# Altium schematic sheet Sheet2.SchDoc
size A; SheetNumber: 1; SheetTotal: 1
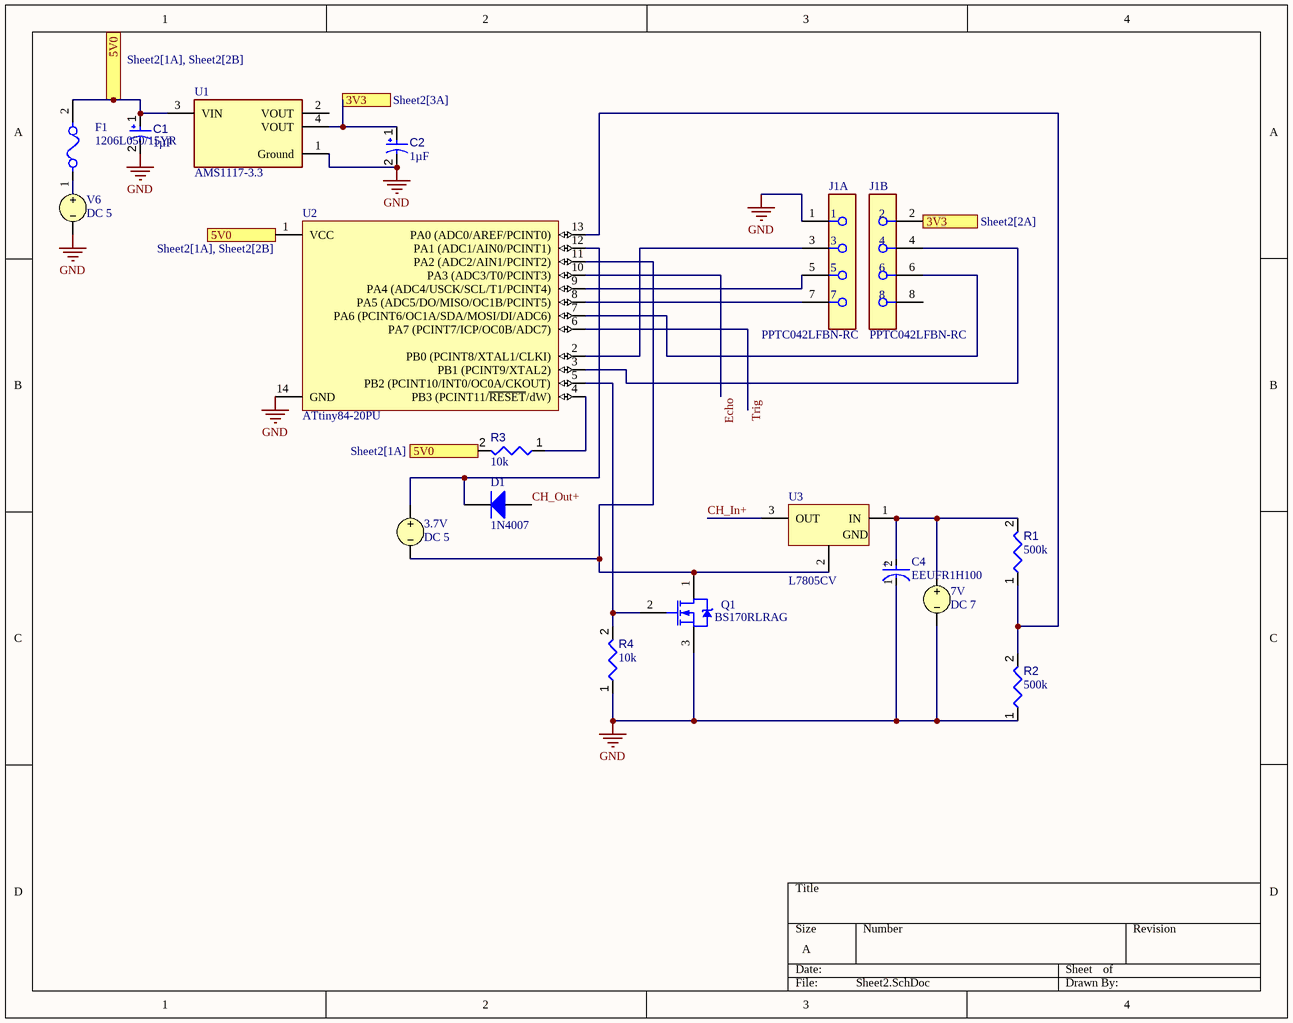
[diagram p0: Sheet2.SchDoc]

## Parts
3.7V  DC 5
7V  DC 7
C1  value 1µF  [CAPPR55-200-1100X500X1200]  (hidden comment: ECA-1HHG010)
C2  value 1µF  [CAPPR55-200-1100X500X1200]  (hidden comment: ECA-1HHG010)
C4  EEUFR1H100  [FP-RAD-TH-D_5_0_5-L_11_1-MFG]
D1  1N4007  [FAIR-DO-41-2]
F1  1206L050/15YR  [FP-1206L-MFG]
J1  PPTC042LFBN-RC  [FP-PPTC042LFBN-RC-MFG]  (parts A,B of 2)
Q1  BS170RLRAG  [ONSC-TO-92-3-29-11_AM_BL]
R1  value 500k  [RESA60-630X240]  (hidden comment: MFR-25FBF52-1K)
R2  value 500k  [RESA60-630X240]  (hidden comment: MFR-25FBF52-1K)
R3  value 10k  [RESA60-630X240]  (hidden comment: MFR-25FBF52-1K)
R4  value 10k  [RESA60-630X240]  (hidden comment: MFR-25FBF52-1K)
U1  AMS1117-3.3  [FP-AMS1117-IPC_C]
U2  ATtiny84-20PU  [14P3]
U3  L7805CV  [TO220]
V6  DC 5

## Ports
3V3 (see Sheet2[2A]), 3V3 (see Sheet2[3A]), 5V0 (see Sheet2[1A]), 5V0 (see Sheet2[1A], Sheet2[2B])

## Nets
GND: 7V.2 C1.2 C2.2 C4.1(C) J1.1 Q1.3(S) R2.1 R4.1 U1.1(Ground) U2.14(GND) V6.2
3V3: C2.1 J1.2 U1.4(VOUT) ; port 3V3
5V0: C1.1 F1.2 R3.2 U1.3(VIN) U2.1(VCC) ; port 5V0
CH_In+: U3.3(OUT)
CH_Out+: D1.2(A)
Echo: U2.10(PA3_(ADC3/T0/PCINT3))
Trig: U2.6(PA7_(PCINT7/ICP/OC0B/ADC7))
Net3.7V_1: 3.7V.1 D1.1(K) U2.12(PA1_(ADC1/AIN0/PCINT1))
Net3.7V_2: 3.7V.2 Q1.1(D) U2.11(PA2_(ADC2/AIN1/PCINT2)) U3.2(GND)
Net7V_1: 7V.1 C4.2(A) R1.2 U3.1(IN)
NetF1_1: F1.1 V6.1
NetJ1_3: J1.3 U2.2(PB0_(PCINT8/XTAL1/CLKI))
NetJ1_4: J1.4 U2.3(PB1_(PCINT9/XTAL2))
NetJ1_5: J1.5 U2.9(PA4_(ADC4/USCK/SCL/T1/PCINT4))
NetJ1_6: J1.6 U2.7(PA6_(PCINT6/OC1A/SDA/MOSI/DI/ADC6))
NetJ1_7: J1.7 U2.8(PA5_(ADC5/DO/MISO/OC1B/PCINT5))
NetQ1_2: Q1.2(G) R4.2 U2.5(PB2_(PCINT10/INT0/OC0A/CKOUT))
NetR1_1: R1.1 R2.2 U2.13(PA0_(ADC0/AREF/PCINT0))
NetR3_1: R3.1 U2.4(PB3_(PCINT11/~{RESET}/dW))

Not connected (* = marked no-connect by the designer): J1 8; U1 2(VOUT)

## Notes on the sheet
- (in symbol CMP-05427-001295-1) +

## Library data of the parts
3.7V V6 = VSRC: Voltage Source; Note: PCB Footprint - Not required; AC Magnitude: 1; AC Phase: 0; Value: 5; Published: 8-Jun-2000; LatestRevisionDate: 17-Jul-2002; LatestRevisionNote: Re-released for DXP Platform.; PackageReference: Not Applicable; Publisher: Altium Limited
7V = VSRC: Voltage Source; Note: PCB Footprint - Not required; AC Magnitude: 0; Value: 7; Published: 8-Jun-2000; LatestRevisionDate: 17-Jul-2002; LatestRevisionNote: Re-released for DXP Platform.; PackageReference: Not Applicable; Publisher: Altium Limited; AC Phase: 0
C1 C2 = CMP-001-00024-7: Aluminum Electrolytic Capacitor, 1 uF, +/- 20%, 50 V, -55 to 105 degC, 2-Pin THD, RoHS, Bulk; Manufacturer: Panasonic; Voltage Rating: 50V; Ripple Current: 10mA; Packaging: Bulk; Package Quantity: 200; Tolerance: 20%; Min Operating Temperature: -55°C; Diameter: 5mm; Capacitor Type: Electrolytic; Datasheet Version: Mar-05; Ripple Current (AC): 10mA; Manufacturer URL: http://www.panasonic.com/; Case/Package: Radial; Mounting Technology: TH; Pins: 2; Package Reference: CAPPR55-200-1100X500X1200; Package Description: 2-Pin Radial Lead, Dia 5 mm, Height 12 mm; RoHS Compliant: True; Max Operating Temperature: 105°C; Lead Pitch: 2mm; Datasheet URL: https://datasheet.ciiva.com/7275/94060-7275472.pdf
C4 = CMP-05427-001295-1: Aluminum Electrolytic Capacitors (Radial Lead Type) 10uF ±20% 50V; Lead Diameter: 0.5mm; Life (Hours): 5000Hour; Impedance: 340mR; Ripple Current (AC): 250mA; REACH SVHC: Yes; Tolerance: 20%; Construction: RADIAL; Min Operating Temperature: -40°C; Termination: Radial; Voltage Rating: 50V; Height: 11mm; Max Operating Temperature: 105°C; Capacitance: 10uF; Voltage: 50V; Diameter: 5mm; Lead Pitch: 2mm; Series: FR Radial; RoHS Compliant: Yes; Case/Package: Radial
D1 = CMP-004-00007-2: General Purpose Rectifier, 1.1 V, 1.0 A, -55 to 175 degC, 2-Pin DO-41, RoHS, Tape and Reel; Manufacturer: Fairchild; Peak Reverse Current: 5uA; Max Surge Current: 30A; Elements: 1; Forward Voltage: 1.1V; Package Version: Rev. 2, 09/2008; Forward Current: 1A; Package Quantity: 5000; Packaging: TapeandReel; Package URL: http://www.fairchildsemi.com/dwg/DO/DO41A.pdf; Manufacturer URL: https://www.fairchildsemi.com/; Package Reference: DO-41-2; Pins: 2; Min Operating Temperature: -55°C; Datasheet Version: Rev. 1.1.0, 11/2014; Max Operating Temperature: 175°C; RoHS Compliant: True; Case/Package: DO-41-2; Mounting Technology: TH; Package Description: 2-Pin Axial Lead, Dia 2.375 mm, Body Length 4.63 mm; Datasheet URL: https://www.fairchildsemi.com/datasheets/1N/1N4007.pdf
F1 = CMP-08606-000030-1: PTC RESET FUSE 15V 500MA 1206; Manufacturer: Littelfuse Inc; Trip Time: 0.1s; Trip Current: 1A; Value: 0.15-0.75Ω; Hold Current: 0.5A; Current Rating: 100A; Device Class L2: PTC Resettable Fuses; Height: 0.75mm; Temperature Range High: +85°C; Automotive: No; Package: 1206L; Lead Free: Yes; Mouser Description: Resettable Fuses - PPTC 15V 1206 .500A POLYFUSE; Digikey Description: PTC RESET FUSE 15V 500MA 1206; Manufacturer Part Number: 1206L050/15YR; Voltage Rating: 15V; Temperature Range Low: -40°C; Device Class L3: unset; Device Class L1: Circuit Protection; ComponentLink2URL: https://www.littelfuse.com/~/media/electronics/datasheets/resettable_ptcs/littelfuse_ptc_1206l_datasheet.pdf.pdf; RoHS: TRUE; Ambient Temperature Range High: +85°C; Temperature: -40°C to +85°C; Resistance: 0.15-0.75Ω; Ambient Temperature Range Low: -40°C; Octopart: https://octopart.com/1206l050%2F15yr-littelfuse-673645; ComponentLink2Description: Datasheet; Category: Fuse
J1 = CMP-25680-000004-1: CONN HDR 8POS 0.1 TIN PCB; Manufacturer: Sullins; Is Female: yes; Conn Orientation: Straight; Conn Gender: Female; Number Of Contacts: 8; Pitch: 2.54mm; Voltage Rating: 250V; Current Rating: 3A; Package: PPTC042LFBN-RC; Number Of Rows: 2; Manufacturer Part Number: PPTC042LFBN-RC; Contact Material: Tin,Nickel; Temperature: -40°C to +105°C; Height: 8.65mm; Device Class L2: Headers and Wire Housings; Octopart: https://octopart.com/pptc042lfbn-rc-sullins-271088; RoHS: TRUE; ComponentLink2URL: https://drawings-pdf.s3.amazonaws.com/10492.pdf; Lead Free: Yes; Automotive: No; Device Class L3: unset; ComponentLink2Description: Datasheet; Temperature Range High: +105°C; Digikey Description: CONN HDR 8POS 0.1 TIN PCB; Category: Conn; Device Class L1: Connectors; Temperature Range Low: -40°C
Q1 = CMP-1058-00945-1: Small Signal MOSFET, 500 mA, 60 V, N-Channel, 3-Pin TO-92, Pb-Free, Tape and Reel; Manufacturer: On Semiconductor; VGS(th) Max (V): 3; V(BR)DSS Min (V): 60; PD Max (W): 0.35; ID Max (A): 0.5; Channel Polarity: N Channel; VGS Max (V): 20; Configuration: Single; PackageDescription: 3-Pin Transistor Outline, Body 4.825 x 3.685 mm, Pitch 1.27 mm; ComponentLink3Description: Package Specification; DatasheetVersion: Rev. 6; RoHS: Pb-Free; Mounting Technology: Through Hole; ComponentLink1Description: Manufacturer URL; PackageVersion: Rev. AM; ComponentLink2Description: Datasheet; ComponentLink1URL: http://www.onsemi.com/; PackageReference: TO-92-3-29-11_AM_BL; ComponentLink3URL: http://www.onsemi.com/pub_link/Collateral/MAC97-D.PDF; Packing: Tape and Reel; PartNumber: BS170RLRAG; ComponentLink2URL: http://www.onsemi.com/pub_link/Collateral/BS170-D.PDF; Package Type: TO-92
R1-R4 = CMP-009-00048-4: Axial Resistor, 1 KOhm, +/- 1%, 250 mW, -55 to 155 degC, 2-Pin THD, RoHS, Bulk; Manufacturer: Yageo; Voltage Rating: 250V; Power: 250mW; Min Operating Temperature: -55°C; Max Operating Temperature: 155°C; Tolerance: 1%; Package Reference: MFR-25; Composition: CarbonFilm; Mounting Technology: TH; Packaging: Bulk; Case/Package: Axial; Datasheet URL: http://www.yageo.com/documents/recent/Yageo%20LR_MFR_2013.pdf; Package Quantity: 200; Manufacturer URL: http://www.yageo.com/; Package Description: 2-Pin Axial Lead, Dia 2.4 mm, Body Length 6.3 mm; Datasheet Version: Apr-13; RoHS Compliant: True
U1 = CMP-209535-000001-1: LDO Voltage Regulators 1A, 3.3V; Manufacturer: Advanced Monolithic Systems; Dropout Voltage: 1.1V; Output Type: Fixed; Nominal Supply Current: 5mA; Max Power Dissipation: 1.2W; Max Supply Voltage: 15V; Number Of Outputs: 1; Standoff Height: 0.64mm; Max Junction Temp: +125°C; Height: 1.8mm; Package: AMS1117; Device Class L2: Power Management ICs; ComponentLink2Description: Datasheet; ComponentLink2URL: http://www.advanced-monolithic.com/pdf/ds1117.pdf; Category: IC; RoHS: TRUE; Automotive: No; Device Class L1: Integrated Circuits (ICs); Output Current: 1A; Device Class L3: Voltage Regulators - Linear; Temperature: -40°C to +125°C; Output Voltage: 3.3V; Manufacturer Part Number: AMS1117-3.3; Temperature Range Low: -40°C; Octopart: https://octopart.com/ams1117-3.3-advanced+monolithic+systems-25899300; Lead Free: Yes; Ipc Land Pattern Name: SOT229P700X180-4; Temperature Range High: +125°C
U2 = CMP-0093-00026-2: 8-bit AVR Microcontroller, 20MHz, 2.7-5.5V, 8KB Flash, 512 Bytes EEPROM, 512 Bytes SRAM, 14-pin PDIP, Industrial Grade (-40°C to 85°C), Pb-Free; PackageDescription: 14-Lead Plastic Dual In-Line, 300 mil/7.62 mm Wide Body (PDIP); Code_JEDEC: MS-001-AA; ComponentLink3Description: ATtiny24/44/84 Summary; ComponentLink2URL: http://www.atmel.com/dyn/resources/prod_documents/doc8006.pdf; ComponentLink1Description: Manufacturer URL; RevisionNote: DatasheetVersion updated. URLs added.; ComponentLink3URL: http://www.atmel.com/dyn/resources/prod_documents/8006S.pdf; PackageReference: 14P3; ComponentLink2Description: ATtiny24/44/84 Datasheet; PackageVersion: revB, Oct-2010; ComponentLink1URL: http://www.atmel.com/; DatasheetVersion: revK, Oct-2010
U3 = CMP-0244-00483-1: Positive Voltage Regulator, 5V, 3-Pin TO-220; PackageDescription: TO, Thru-Hole, Vertical, Heatsink Mounted; 3 In-Line Leads; Pitch 2.54 mm; ComponentLink2Description: Datasheet; PackageReference: TO220; ComponentLink3URL: http://www.st.com/internet/com/TECHNICAL_RESOURCES/TECHNICAL_LITERATURE/PACKAGE_INFORMATION/CD00004649.pdf; DatasheetVersion: 16/11/2011; ComponentLink1Description: Manufacturer URL; ComponentLink1URL: http://www.st.com; PackageVersion: ver3.0; ComponentLink3Description: Package Specification; ComponentLink2URL: http://www.st.com/internet/com/TECHNICAL_RESOURCES/TECHNICAL_LITERATURE/DATASHEET/CD00000444.pdf